# EAGLE design ASL2112 (EAGLE 6.3)
DATABASE: ./../../../../../Components/TinyCircuits_Part_Database.txt
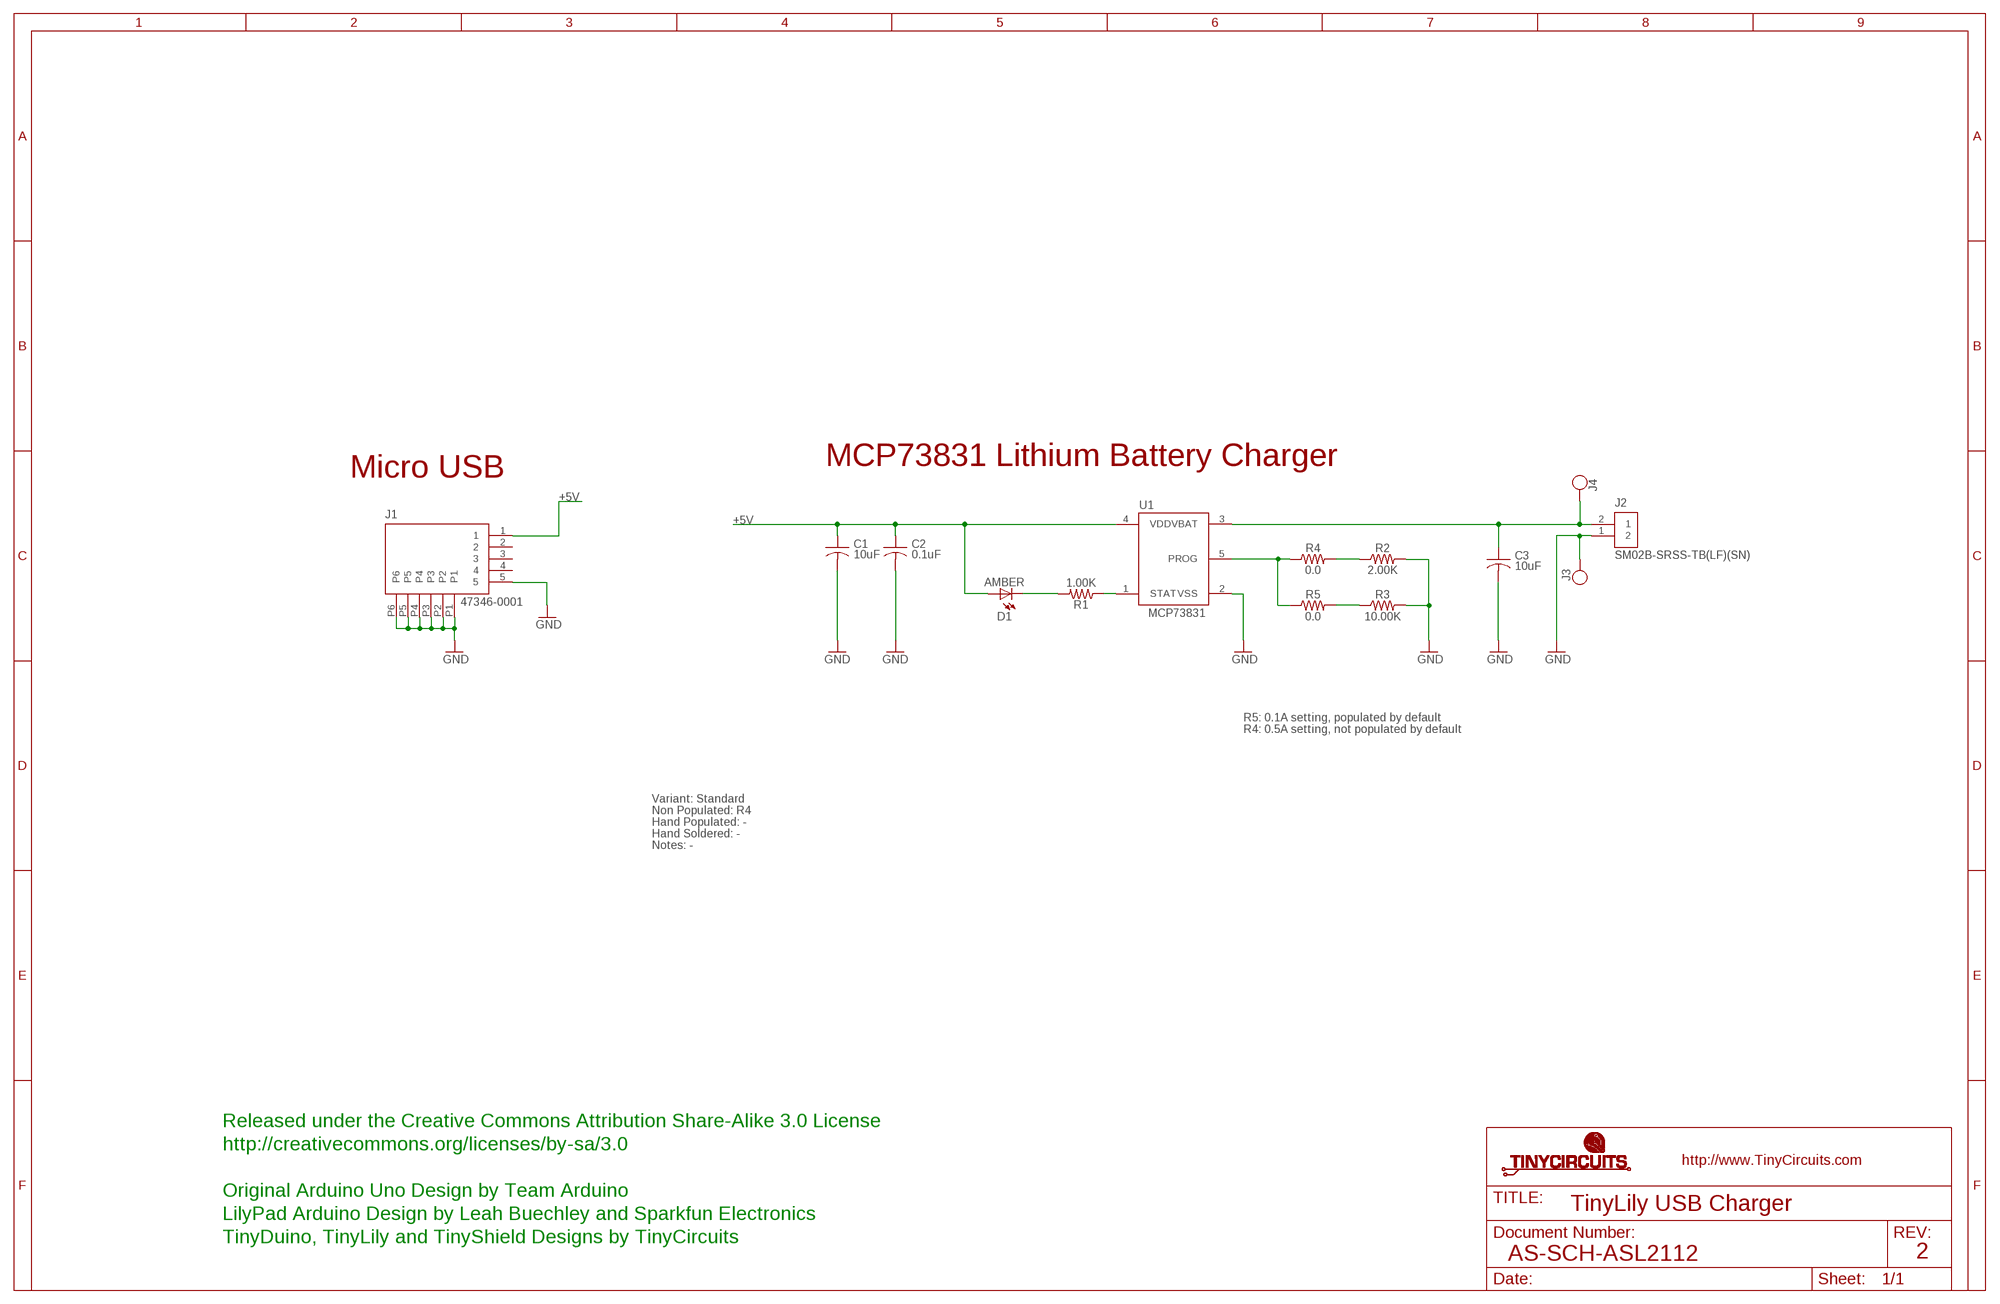
[diagram p0: schematic, sheet 1]

## Parts
C1  10uF  AS-ITM-00002  [C0603]
C2  0.1uF  AS-ITM-00008  [C0402]
C3  10uF  AS-ITM-00002  [C0603]
D1  AMBER  AS-ITM-00058  [0402_LED]
J1  47346-0001  AS-ITM-00021  [MICRO_USB]
J2  SM02B-SRSS-TB(LF)(SN)  AS-ITM-00231  [JST_SH_2X1]
J3  PIN_1X.1"1  [1X.1"_2]
J4  PIN_1X.1"1  [1X.1"_2]
R1  1.00K  AS-ITM-00003  [0402]
R2  2.00K  AS-ITM-00315  [0402]
R3  10.00K  AS-ITM-00032  [0402]
R4  0.0  AS-ITM-00076  [0402]
R5  0.0  AS-ITM-00076  [0402]
U1  MCP73831  AS-ITM-00136  [SOT-23]

## Nets
+5V: C1.1 C2.1 D1.1(A) J1.1 U1.4(VDD)
GND: C1.2 C2.2 C3.2 J1.5 J1.P1 J1.P2 J1.P3 J1.P4 J1.P5 J1.P6 J2.1 J3.1 R2.2 R3.2 U1.2(VSS)
N$1: R1.1 U1.1(STAT)
N$2: D1.2(C) R1.2
N$3: R4.1 R5.1 U1.5(PROG)
N$4: R2.1 R4.2
N$5: C3.1 J2.2 J4.1 U1.3(VBAT)
N$7: R3.1 R5.2
Unconnected: J1.2 J1.3 J1.4

## Notes on the sheet
- MCP73831 Lithium Battery Charger
- Micro USB
- R5: 0.1A setting, populated by default
- R4: 0.5A setting, not populated by default
- Variant: Standard
- Non Populated: R4
- Hand Populated: -
- Hand Soldered: -
- Notes: -
- Released under the Creative Commons Attribution Share-Alike 3.0 License
- http://creativecommons.org/licenses/by-sa/3.0
- Original Arduino Uno Design by Team Arduino
- TinyLily USB Charger
- LilyPad Arduino Design by Leah Buechley and Sparkfun Electronics
- TinyDuino, TinyLily and TinyShield Designs by TinyCircuits
- AS-SCH-ASL2112 | 2

## Library data of the parts
C1 C3 = tinycircuits:AS-ITM-00002: CAP CER 10UF 10V 20% X5R 0603; PARTNO: AS-ITM-00002
C2 = tinycircuits:AS-ITM-00008: CAP CER 0.1UF 16V 10% X5R 0402; PARTNO: AS-ITM-00008
D1 = tinycircuits:AS-ITM-00058: LED 0402 AMBER WTR CLR SMD; PARTNO: AS-ITM-00058
J1 = tinycircuits:AS-ITM-00021: CONN RCPT 5POS MICRO USB R/A; PARTNO: AS-ITM-00021; PNPROTATION: 90
J2 = tinycircuits:AS-ITM-00231: CONN HEADER SH 2POS SIDE 1MM; PARTNO: AS-ITM-00231; PNPROTATION: 180
J3 J4 = tinycircuits:PIN_1X.1": 1 Pin 0.100" Header
R1 = tinycircuits:AS-ITM-00003: RES 1.00K OHM 1/16W 1% 0402; PARTNO: AS-ITM-00003
R2 = tinycircuits:AS-ITM-00315: RES SMD 2K OHM 1% 1/16W 0402; PARTNO: AS-ITM-00315; VALUE: 2K
R3 = tinycircuits:AS-ITM-00032: RES 10.0K OHM 1/16W 1% 0402 SMD; PARTNO: AS-ITM-00032; VALUE: 10.0K
R4 R5 = tinycircuits:AS-ITM-00076: RES 0.0 OHM 1/16W 1% 0402 SMD; PARTNO: AS-ITM-00076
U1 = tinycircuits:AS-ITM-00136: IC CONTROLLER LI-ION 4.2V SOT23-5; PARTNO: AS-ITM-00136; PNPROTATION: 270

## Net classes
2 gnd: width 0.305 mm, drill 0.559 mm, clearance 0.254 mm

## Board
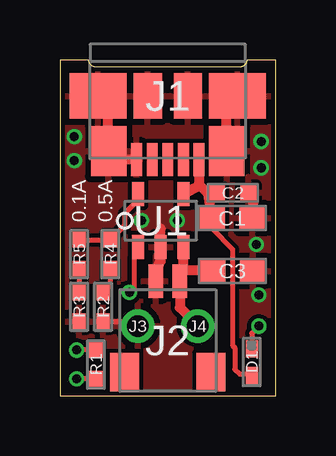
[diagram p1: board, top side]
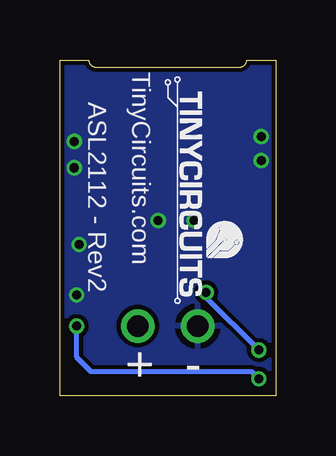
[diagram p2: board, bottom side, seen from below]

Size 9 x 14 mm. Coordinates in mm from the lower left corner, seen from the top.
Outline: 0,0 9,0 9,14 7.8,14 arc-90 7.5,13.7 1.5,13.7 arc-90 1.2,14 0,14 0,0
Copper layers (1*16): Top 0.035mm / dielectric 1.5mm / Bottom 0.035mm
Design rules "default *": minimum track width 8mil, minimum drill 15mil, track to track 7mil, track to pad 7mil, pad to pad 7mil, via to via 7mil, smd to smd 7mil, copper to edge 7mil, drill to drill 8mil, minimum pad ring 8mil, minimum via ring 5mil, stop-mask expansion 4mil, vias tented up to drill 25mil, thermal gap 10mil
tRestrict: 1 lines
bRestrict: 1 lines

### Footprints (pad centres in the part's own frame; a part is rotated, then mirrored left to right if it is on the bottom)
C0603 = smd 1.1 x 1: 1 -0.85,0; 2 0.85,0
C0402 = smd 0.65 x 0.6: 1 -0.65,0; 2 0.65,0
0402_LED = smd 0.7 x 0.5: 1 -0.55,0; 2 0.55,0
MICRO_USB = smd 1.38 x 0.45: 1 2.66,1.3; 2 2.66,0.65; 3 2.66,0; 4 2.66,-0.65; 5 2.66,-1.3 | smd 2.1 x 1.475: P1 2.3,-2.462; P2 2.3,2.462 | smd 1.9 x 2.375: P3 0,2.913; P4 0,-2.913 | smd 1.9 x 1.175: P5 0,0.838; P6 0,-0.838
JST_SH_2X1 = smd 0.6 x 1.4: 1 -0.5,2.475; 2 0.5,2.475 | smd 1.2 x 1.6: PAD1 -1.8,-1.325; PAD2 1.8,-1.325
1X.1"_2 = drill 0.889 pad 1.397: 1 0,0
0402 = smd 0.65 x 0.55: 1 -0.6,0; 2 0.6,0
SOT-23 = smd 0.5 x 1: 1 -0.95,-1.1; 2 0,-1.1; 3 0.95,-1.1; 4 0.95,1.1; 5 -0.95,1.1

### Placement (x,y rotation side)
C1  7.19,7.4 0 top
C2  7.21,8.46 0 top
C3  7.2,5.2 0 top
D1  8,1.4 90 top
J1  4.5,12.5 270 top
J2  4.5,2.3 0 top
J3  3.25,2.9 0 top
J4  5.75,2.9 0 top
R1  1.5,1.3 270 top
R2  1.8,3.7 270 top
R3  0.8,3.7 270 top
R4  2.1,5.9 270 top
R5  0.8,5.9 270 top
U1  4.2,7.3 0 top
U$1  [DOCFIELD-TINYCIRCUITS-PCB]  28.5,-11 0 top  (outside the outline)

### Tracks (layer width: path | path; a pad name or v marks a point on that pad's centre or on a via)
+5V
  Top 0.203: C2.1 6.2,8.46 6.2,8.4 | C1.1 6.34,6.96 7.2,6.1 7.2,2.1 7.3,2 7.3,1.1 7.5,0.9 7.95,0.9 D1.1
  Top 0.406: J1.1 5.8,8.8 | 5.8,8.8 5.8,8.75 U1.4 | C1.1 6.2,8.4 5.8,8.8
GND  (via drill 0.38)
  Top 0.203: 2,11.6 1.59,12.01 J1.P4 | 6.95,11.6 7.41,12.06 J1.P3 | 6.95,11.2 6.96,11.19 J1.P2 | R2.2 3.03,3.1 J3.1
  Top 0.406: J1.5 2.4,9.84 J1.P1 | C2.2 8.06,8.22 C1.2 | J2.1 4.1,5.4 4.2,5.6 U1.2 | 4.2,6.55 4.2,6.95 | 6.95,11.2 6.95,11.6 | 2,11.2 2,11.6
  other vias: 4.9,7.3 3.4,7.3 8.3,4.2 8.4,9.5 0.6,10.8 0.6,9.8 8.2,6.3 8.4,10.6
  pour Bottom: 0,14 9,14 9,0 0,0
  pour Top: 0,14 9,14 9,0 0,0
N$1  (via drill 0.38)
  Top 0.203: U1.1 3.1,5.75 3.1,4.5 v2.9,4.3 | R1.1 v0.7,1.9
  Bottom 0.203: v0.7,1.9 2.9,4.1 v2.9,4.3
N$2  (via drill 0.38)
  Top 0.203: R1.2 v0.7,0.7 | v8.3,2.9 8,2.6 D1.2
  Bottom 0.203: v0.7,0.7 1,1 7.7,1 8.3,1.6 v8.3,2.9
N$3
  Top 0.203: R5.1 R4.1 2.7,7.1 2.7,7.6 3.25,8.15 U1.5
N$4
  Top 0.203: R4.2 2.1,4.6 R2.1
N$5
  Top 0.406: 5.15,5.23 J2.2 5,3.67 J4.1 | 5.15,5.23 U1.3 | C3.1 6.23,5.23 5.15,5.23
N$7
  Top 0.203: R5.2 R3.1

### Text on the board
tPlace: 0.1A | 0.5A
bPlace: TinyCircuits.com | ASL2112 - Rev2 | - | +
Document: FABRICATION DRAWING | NOTES: | 1. PRINTED CIRCUIT BOARD MADE FROM NEMA GRADE FR-4 EPOXY LAMINATE | WITH 1 OUNCE COPPER PLATING AND .024 THICKNESS. | 2. ALL DIMENSIONS ARE GIVEN IN INCHES. | 3. CIRCUIT PATHS ARE FOR REFERENCE ONLY. | 4. HOLE SIZES SHOWN ARE FINISHED DIAMETERS AFTER PLATING. | 5. BOARD PLATED USING REFLOW OR SIMILAR METHOD. | 6. BOARD TO HAVE BLUE SOLDER MASK ON PLATED SURFACES USING WET FILM | 7. SILKSCREEN BOARD USING WHITE INK. | SR100 OR SR1010 EPOXY. EQUIVALENT WET OR DRY FILM MAY BE USED. | 8. THE FOLLOWING INFORMATION APPLIES TO THIS BOARD: | * 2 COPPER LAYERS | * .024 BOARD THICKNESS | * REQUIRES TOP SIDE SILKSCREEN | Released under the Creative Commons Attribution Share-Alike 3.0 License | http://creativecommons.org/licenses/by-sa/3.0 | Original Arduino Uno Design by Team Arduino | LilyPad Arduino Design by Leah Buechley and Sparkfun Electronics | TinyDuino, TinyLily and TinyShield Designs by TinyCircuits | TinyLily USB Charger | AS-PCB-ASL2112 | 2